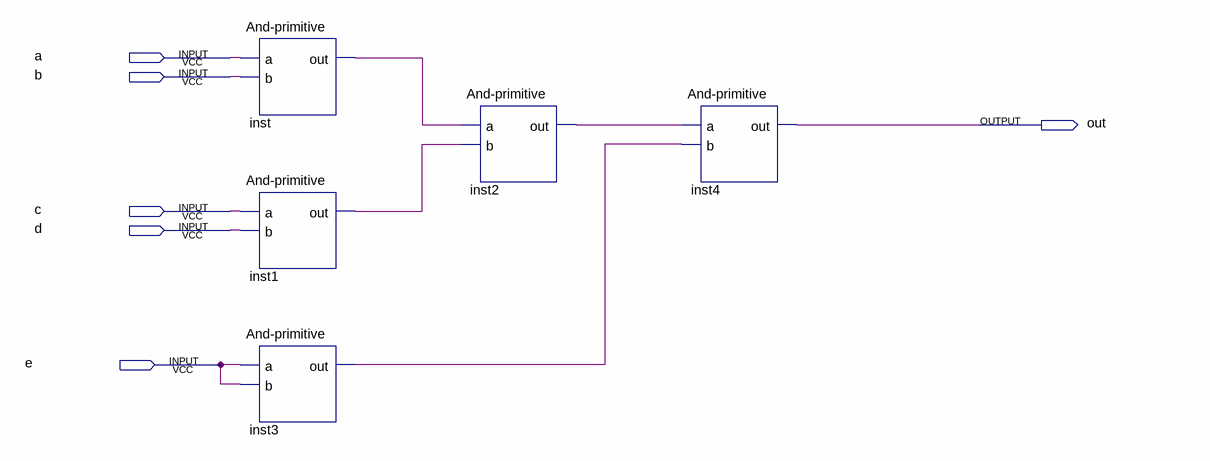
[diagram p0: schematic sheet]
// Quartus schematic And5-primitive.bdf as structural Verilog: 5 symbols, 6 pins
module \And5-primitive  (
  input  a,
  input  b,
  input  c,
  input  d,
  input  e,
  output out
);

  wire inst1_out, inst2_out, inst3_out, inst_out;

  \And-primitive  inst (.a(a), .b(b), .out(inst_out));
  \And-primitive  inst1 (.a(c), .b(d), .out(inst1_out));
  \And-primitive  inst3 (.a(e), .b(e), .out(inst3_out));
  \And-primitive  inst2 (.a(inst_out), .b(inst1_out), .out(inst2_out));
  \And-primitive  inst4 (.a(inst2_out), .b(inst3_out), .out(out));
endmodule
